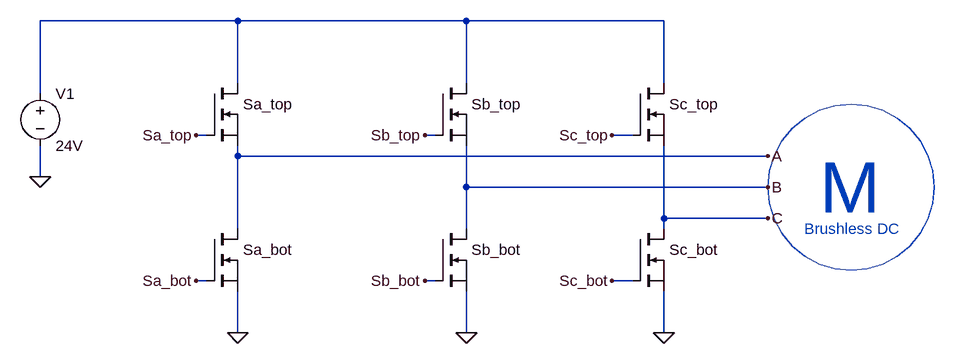
[diagram p0: schematic bridge_BLDC.asc]
bridge_BLDC.asc, the LTspice schematic file:
Version 4
SHEET 1 1204 680
WIRE -80 -32 -384 -32
WIRE 272 -32 -80 -32
WIRE 576 -32 272 -32
WIRE -80 64 -80 -32
WIRE 272 64 272 -32
WIRE 576 64 576 -32
WIRE -384 80 -384 -32
WIRE -128 144 -144 144
WIRE 224 144 208 144
WIRE 528 144 496 144
WIRE -80 176 -80 160
WIRE 736 176 -80 176
WIRE -384 208 -384 160
WIRE 272 224 272 160
WIRE 736 224 272 224
WIRE 576 272 576 160
WIRE 736 272 576 272
WIRE -80 288 -80 176
WIRE 272 288 272 224
WIRE 576 288 576 272
WIRE -128 368 -144 368
WIRE 224 368 208 368
WIRE 528 368 496 368
WIRE -80 448 -80 384
WIRE 272 448 272 384
WIRE 576 448 576 384
FLAG -144 144 Sa_top
FLAG -144 368 Sa_bot
FLAG 208 144 Sb_top
FLAG 208 368 Sb_bot
FLAG 496 144 Sc_top
FLAG 496 368 Sc_bot
FLAG -80 448 0
FLAG 272 448 0
FLAG 576 448 0
FLAG -384 208 0
FLAG 736 176 A
FLAG 736 224 B
FLAG 736 272 C
SYMBOL nmos -128 64 R0
SYMATTR InstName Sa_top
SYMATTR Value ""
SYMBOL nmos -128 288 R0
SYMATTR InstName Sa_bot
SYMATTR Value ""
SYMBOL nmos 224 64 R0
SYMATTR InstName Sb_top
SYMATTR Value ""
SYMBOL nmos 224 288 R0
SYMATTR InstName Sb_bot
SYMATTR Value ""
SYMBOL nmos 528 64 R0
SYMATTR InstName Sc_top
SYMATTR Value ""
SYMBOL nmos 528 288 R0
SYMATTR InstName Sc_bot
SYMATTR Value ""
SYMBOL voltage -384 64 R0
WINDOW 123 0 0 Left 2
WINDOW 39 0 0 Left 2
SYMATTR InstName V1
SYMATTR Value 24V
TEXT 792 288 Left 2 ;Brushless DC
TEXT 816 224 Left 7 ;M
CIRCLE Normal 992 352 736 96

The netlist it stands for:
* bridge_BLDC.asc
M§Sa_top N001 Sa_top A A
M§Sa_bot A Sa_bot 0 0
M§Sb_top N001 Sb_top B B
M§Sb_bot B Sb_bot 0 0
M§Sc_top N001 Sc_top C C
M§Sc_bot C Sc_bot 0 0
V1 N001 0 24V
.model NMOS NMOS
.model PMOS PMOS
.lib standard.mos
* Brushless DC
* M
.backanno
.end